# Altium schematic sheet RS-485_SN65HVD72DRBR.SchDoc
size A4; SheetNumber: 7; SheetTotal: 7
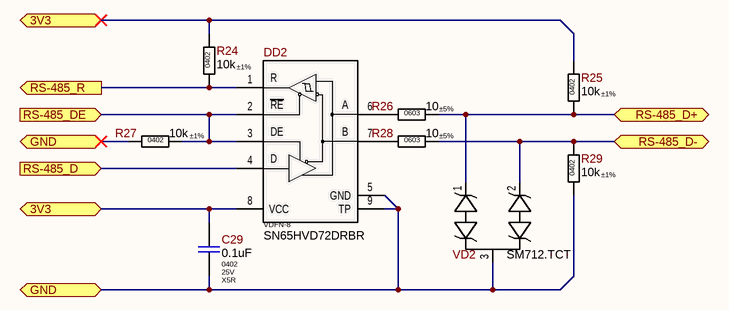
[diagram p0: RS-485_SN65HVD72DRBR.SchDoc]

## Parts
C29  Package: 0402  Voltage: 25V  Dielectric Type: X5R  [C_CERAMIC_0402_MED]  (hidden comment: 0.1uF)
DD2  Package: VDFN-8  [TI-SON8-65P300X100_HS]  (hidden comment: SN65HVD72DRBR)
R24  Tolerance: ±1%  Package: 0402  [R_ANY_CHIP_0402_MED]  (hidden comment: 10k)
R25  Tolerance: ±1%  Package: 0402  [R_ANY_CHIP_0402_MED]  (hidden comment: 10k)
R26  Tolerance: ±5%  Package: 0603  [R_ANY_CHIP_0603_MED]  (hidden comment: 10)
R27  Tolerance: ±1%  Package: 0402  [R_ANY_CHIP_0402_MED]  (hidden comment: 10k)
R28  Tolerance: ±5%  Package: 0603  [R_ANY_CHIP_0603_MED]  (hidden comment: 10)
R29  Tolerance: ±1%  Package: 0402  [R_ANY_CHIP_0402_MED]  (hidden comment: 10k)
VD2  SM712.TCT  [SOT-23_MED]

## Ports
3V3 (bidir, see DefaultProject[4C]), GND (bidir, see DefaultProject[4C]), RS-485_D (in, see DefaultProject[4C]), RS-485_D+ (bidir, see DefaultProject[5C]), RS-485_D- (bidir, see DefaultProject[5C]), RS-485_DE (in, see DefaultProject[4C]), RS-485_R (out, see DefaultProject[4C])

## Nets
3V3: C29.1 DD2.8(VCC) R24.1 R25.1 ; port 3V3
GND: C29.2 DD2.5(GND) DD2.9(TP) R27.2 R29.2 VD2.3 ; port GND
RS-485_D: DD2.4(DI) ; port RS-485_D
RS-485_D+: R25.2 R26.2 VD2.1 ; port RS-485_D+
RS-485_D-: R28.2 R29.1 VD2.2 ; port RS-485_D-
RS-485_DE: DD2.2(~{RE}) DD2.3(DE) R27.1 ; port RS-485_DE
RS-485_R: DD2.1(RO) R24.2 ; port RS-485_R
NetDD2_6: DD2.6(A) R26.1
NetDD2_7: DD2.7(B) R28.1

## Notes on the sheet
- (in symbol SN65HVD7xDRB) R; RE; D

## Library data of the parts
C29 = Capacitor-NonPolar: 100nF 25V X5R ±10% 0402 Ceramic Capacitor RoHS; Part Number: CL05A104KA5NNNC; Manufacturer: Samsung Electro-Mechanics; Standard Lead Time: 38 Weeks; Component Status: Released; Replacement: NONE; Value: 0.1uF; Part Type: Ceramic / X5R / 0402; Component Type: SMD; Temperature Range: -55°C ~ 85°C; Tolerance: ±10%; ComponentLink1URL: https://eu.mouser.com/datasheet/2/585/MLCC-1837944.pdf; ComponentLink1Description: Datasheet; Price: 0.0013; Supplier 1: Mouser; Supplier Part Number 1: 187-CL05A104KA5NNNC
DD2 = SN65HVD7xDRB: 3.3V 1/1 Transceiver Half RS422 Up to 250 kbps, RS485 With IEC ESD protection, SON-8; Manufacturer: Texas Instruments; Standard Lead Time: 16 Weeks; Component Status: Released; Replacement: NONE; Part Number: SN65HVD72DRBR; Part Type: Transceivers / RS-232/RS-422/RS-485; Component Type: SMD; Temperature Range: -40°C ~ 125°C; ComponentLink1URL: https://www.ti.com/lit/ds/symlink/sn65hvd72.pdf; Supplier 1: Digi-Key; Supplier Part Number 1: 296-40520-2-ND; Price: 0.709; ComponentLink1Description: Datasheet
R24 R25 R27 R29 = Resistor: 10 kOhms ±1% 1/16W 0402 Thick Film Resistor; Part Number: RC0402FR-0710KL; Manufacturer: Yageo; Power Rating: 0.062W; Voltage: 50V; Temperature Stability: ±100ppm/°C; Replacement: NONE; Component Status: Released; Value: 10k; Component Type: SMD; Temperature Range: -55°C ~ 155°C; ComponentLink1URL: https://eu.mouser.com/datasheet/2/447/PYu_RC_Group_51_RoHS_L_10-1664068.pdf; Supplier 1: Digi-Key; Supplier Part Number 1: 311-10.0KLRTR-ND; ComponentLink1Description: Datasheet; Part Type: Thick Film; Price: 0,00065
R26 R28 = Resistor: 10 Ohms ±5%, 1/10W 0603 Thick Film Resistor; Part Number: RC0603JR-0710RL; Manufacturer: Yageo; Power Rating: 0.1W; Voltage: 75V; Component Status: Released; Temperature Stability: ±200ppm/°C; Replacement: NONE; Value: 10; Component Type: SMD; Part Type: Thick Film; Temperature Range: -55°C ~ 155°C; ComponentLink1URL: https://eu.mouser.com/datasheet/2/447/Yageo_03_18_2021_PYu_RC_Group_51_RoHS_L_11-2199992.pdf; Supplier 1: Mouser; Supplier Part Number 1: 603-RC0603JR-0710RL; Price: 0.0006; ComponentLink1Description: Datasheet
VD2 = SM712.TCT: TVS Diode 26V and 19V Clamp, 21A and 38A (8/20us) Ipp, SOT-23; Manufacturer: Semtech; Marking: 712; Component Status: Released; Standard Lead Time: 2 Weeks; Current: 21A, 38A; Voltage: 13.3V, 7.5V; Replacement: NONE; Part Number: SM712.TCT; Part Type: TVS / ESD Protection; Component Type: SMD; Package: SOT-23; Temperature Range: -55°C ~ 125°C; ComponentLink1URL: https://semtech.my.salesforce.com/sfc/p/#E0000000JelG/a/440000001MKW/f6pBKheIN2CeR0DxWdS3THuJ7nh4aKYltSzghsLP5iw; Supplier 1: Digi-Key; Supplier Part Number 1: SM712TR-ND; Price: 0,25; ComponentLink1Description: Datasheet